# Altium project SmartChessBoard.PrjPcb
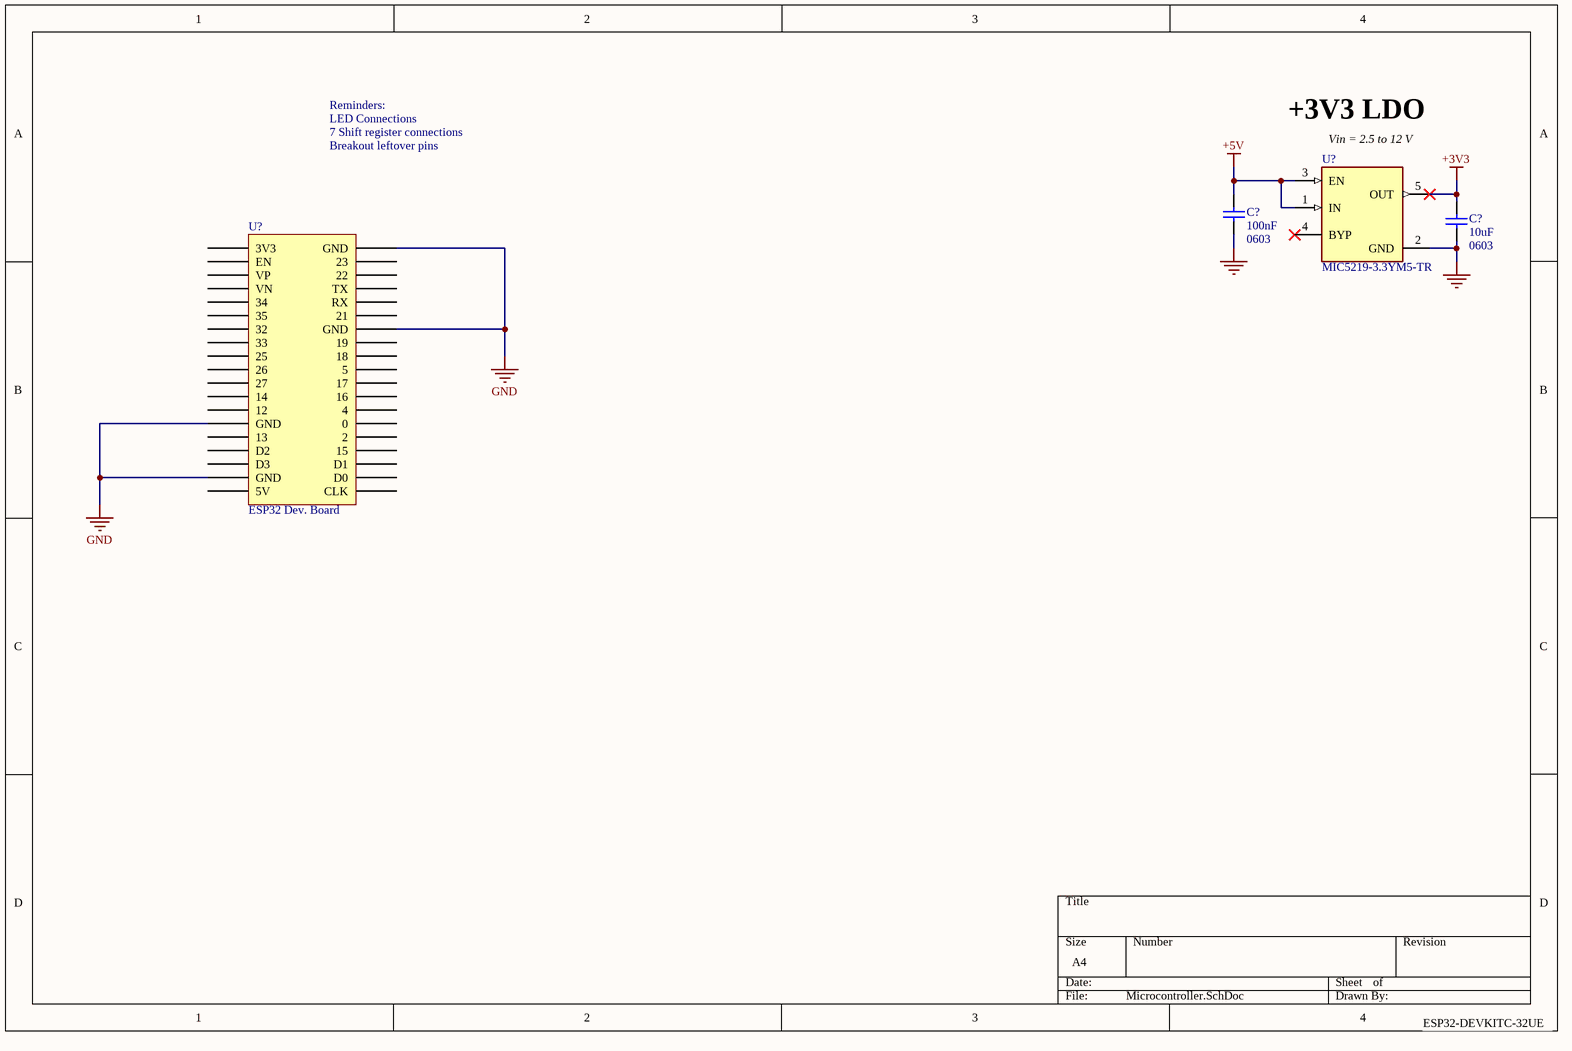
[diagram p0: Microcontroller.SchDoc]
4 sheets, 271 parts. Net scope: flat (ports and power ports of the same name join across sheets).
Board file: Chess Board PCB.PcbDoc
Sheets:
  Microcontroller.SchDoc
  Reed Switches.SchDoc
  LEDs.SchDoc
  Shift Registers.SchDoc

## Sheet Microcontroller.SchDoc
size A4; SheetNumber: 1; SheetTotal: 4

### Parts
(Parts that share a designator on the sheet are numbered #1, #2 ... from top to bottom, then left to right.)
C?#1  100nF  value 0603  [0603 CAP SAMSUNG CL10C]
C?#2  10uF  value 0603  [0603 CAP]
U?#1  MIC5219-3.3YM5-TR  [FP-SOT23-5LD-PL-1-IPC_C]
U?#2  ESP32 Dev. Board

### Nets
+3V3: C?#2.2 U?#1.5(OUT)
+5V: C?#1.2 U?#1.1(IN) U?#1.3(EN)
GND: C?#1.1 C?#2.1 U?#1.2(GND) U?#2.14(GND) U?#2.18(GND) U?#2.32(GND) U?#2.38(GND)

Not connected (* = marked no-connect by the designer): U?#1 4(BYP)*; U?#2 1(3V3) 2(EN) 3(VP) 4(VN) 5(34) 6(35) 7(32) 8(33) 9(25) 10(26) 11(27) 12(14) 13(12) 15(13) 16(D2) 17(D3) 19(5V) 20(CLK) 21(D0) 22(D1) 23(15) 24(2) 25(0) 26(4) 27(16) 28(17) 29(5) 30(18) 31(19) 33(21) 34(RX) 35(TX) 36(22) 37(23)

### Notes on the sheet
- Reminders:
- LED Connections
- 7 Shift register connections
- Breakout leftover pins
- +3V3 LDO
- (near U?#1) Vin = 2.5 to 12 V
- ESP32-DEVKITC-32UE

### Library data of the parts
C?#1 C?#2 = Cap: Capacitor; Published: 8-Jun-2000; LatestRevisionDate: 17-Jul-2002; LatestRevisionNote: Re-released for DXP Platform.; PackageReference: RAD-0.3; Publisher: Altium Limited; PackageDescription: Radial Cap, Thru-Hole; 2 Leads; 0.3 in Pin Spacing
U?#1 = CMP-06324-000027-1: IC REG LINEAR 3.3V 500MA SOT23-5; Dropout Voltage: 350mV; Output Type: Fixed; Number of Regulators: 1; Max Input Voltage: 12V; Min Input Voltage: 2.5V; Min Operating Temperature: -40°C; Nominal Output Voltage: 3.3V; Output Voltage: 3.3V; Packaging: Cut Tape; Mount: Surface Mount; Number of Pins: 5; Case/Package: SOT-23-5; Lead Free: Lead Free; Max Operating Temperature: 125°C; REACH SVHC: No SVHC; Output Current: 500mA
U?#2 = ESP32 Dev. Board: ESP32-WROOM-32UE Series Evaluation Board 802.11 b/g/n (WiFi, WLAN) Bluetooth Smart Ready 4.x Dual Mode; Manufacturer: Espressif Systems; Manufacturer Part Number: ESP32-DEVKITC-32UE; Supplier: Digikey; Supplier Part Number: 1965-ESP32-DEVKITC-32UE-ND; RoHS: No; Category: RF Semiconductors and Devices; Stock: 498; Pricing: 1=10 (USD); ComponentLink1URL: https://www.espressif.com/sites/default/files/documentation/espressif_products_ordering_information_en.pdf?src-supplier=Digikey; ComponentLink1Description: https://www.espressif.com/sites/default/files/documentation/espressif_products_ordering_information_en.pdf?src-supplier=Digikey; ComponentLink2URL: https://datasheet.octopart.com/ESP32-DEVKITC-32UE-Espressif-Systems-datasheet-165560559.pdf?src-supplier=TME; ComponentLink2Description: https://datasheet.octopart.com/ESP32-DEVKITC-32UE-Espressif-Systems-datasheet-165560559.pdf?src-supplier=TME

## Sheet Reed Switches.SchDoc
size A3; SheetNumber: 3; SheetTotal: 5
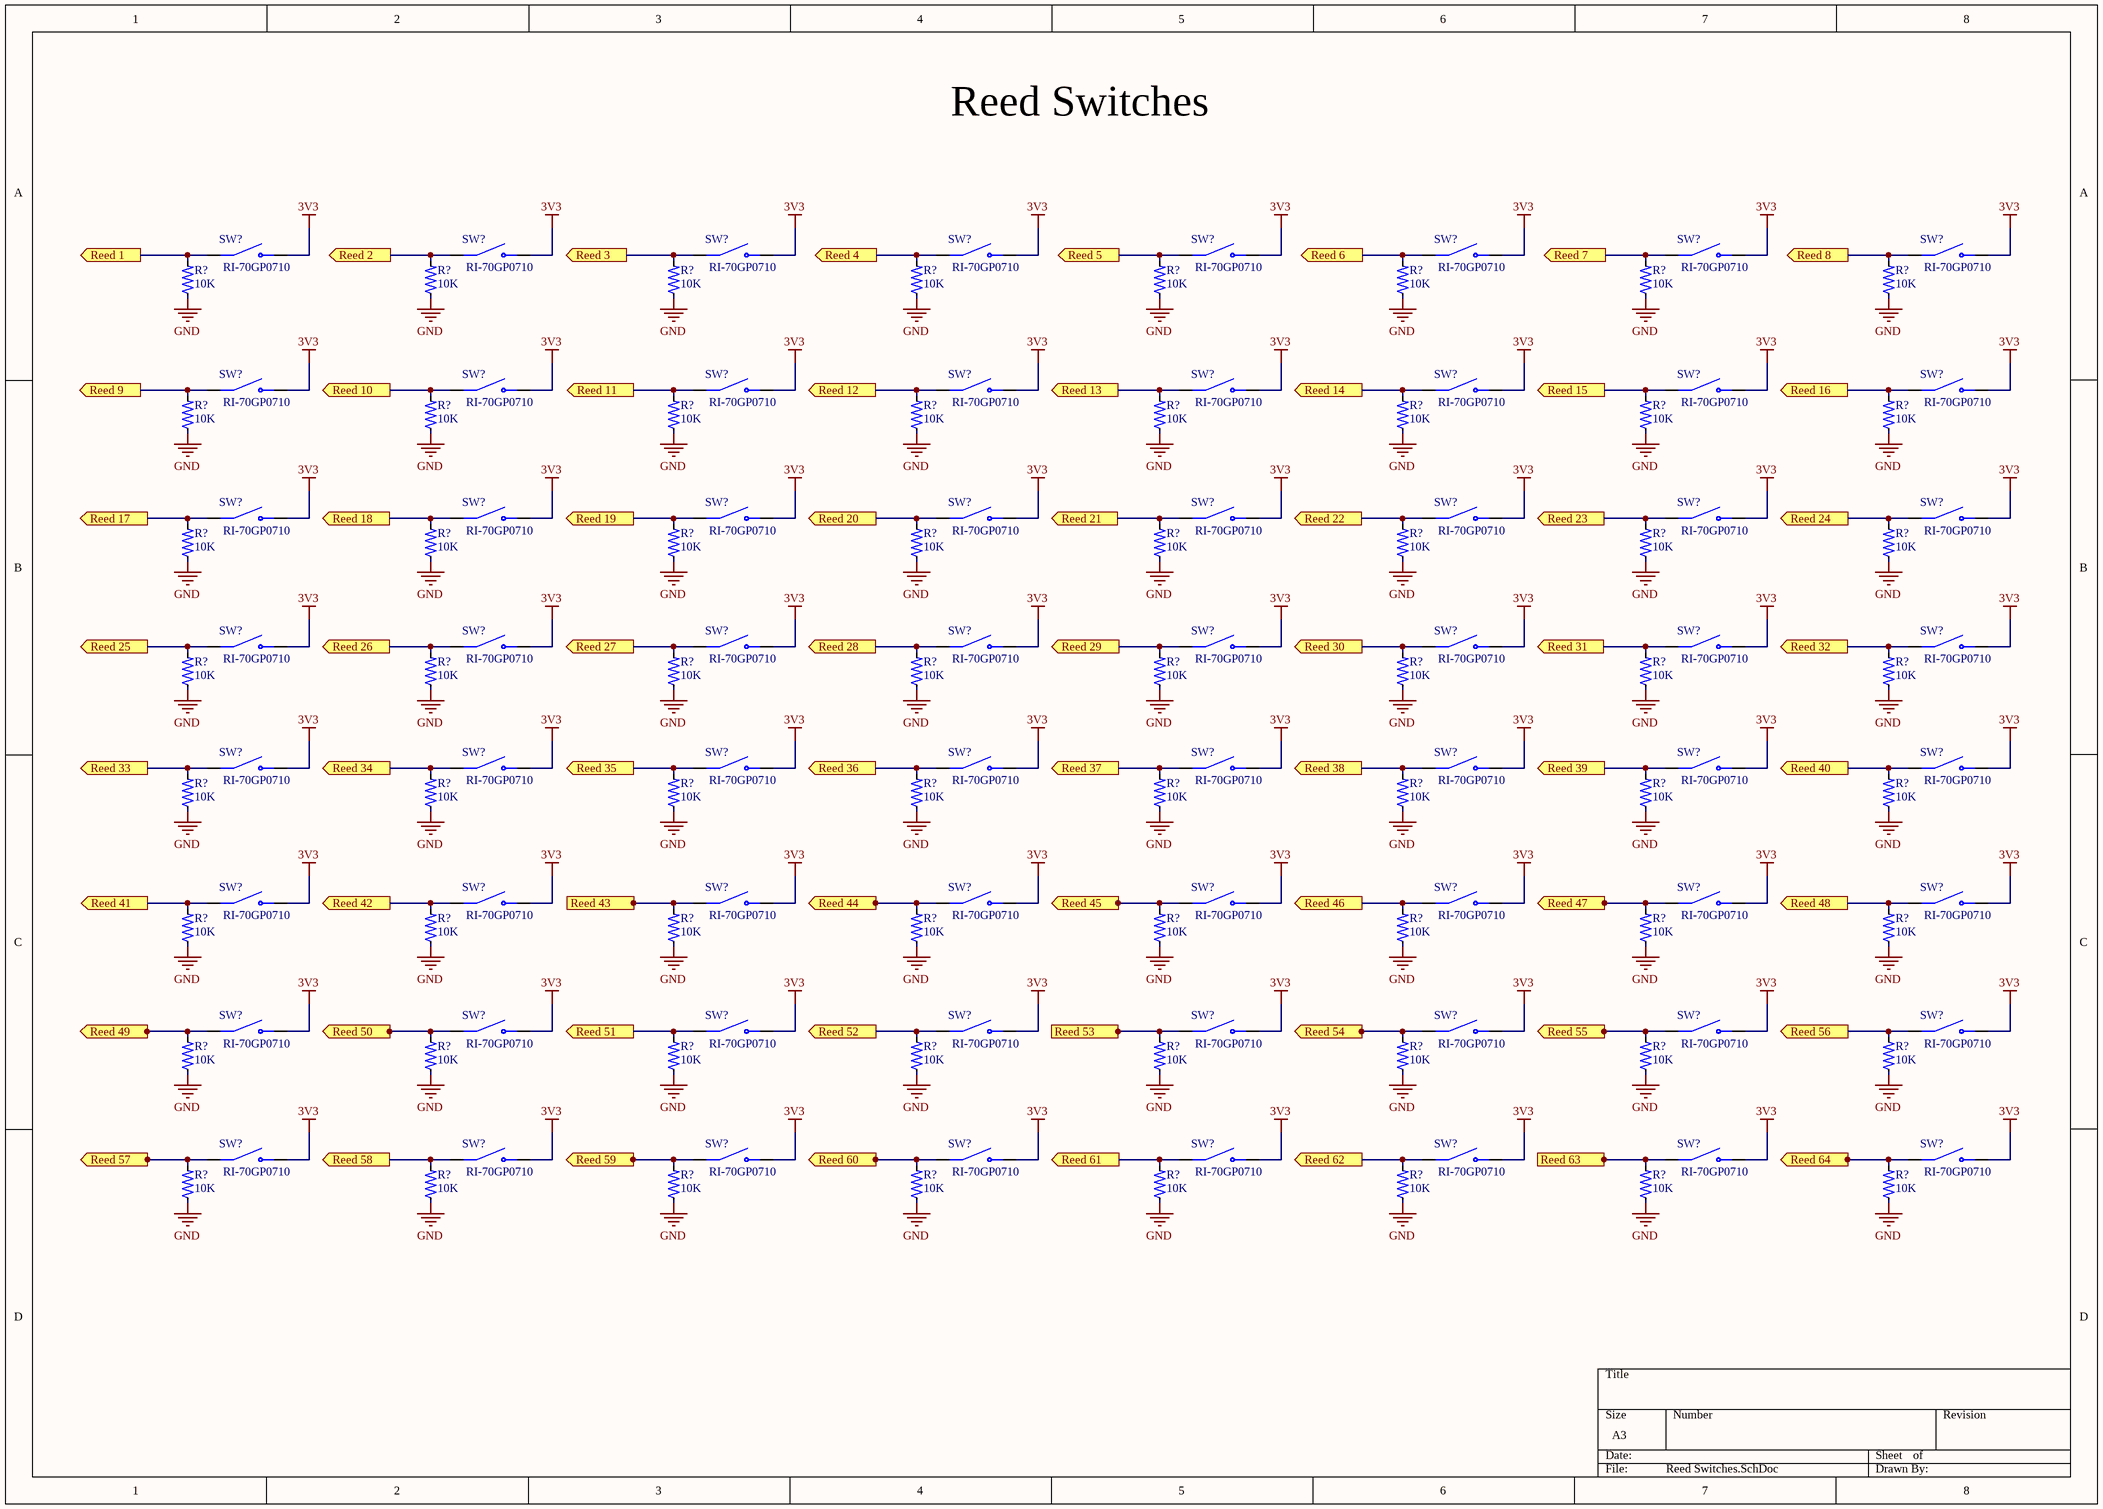
[diagram p1: Reed Switches.SchDoc]

### Parts
(Parts that share a designator on the sheet are numbered #1, #2 ... from top to bottom, then left to right.)
R?#1  10K  [res 0805]
R?#2  10K  [res 0805]
R?#3  10K  [res 0805]
R?#4  10K  [res 0805]
R?#5  10K  [res 0805]
R?#6  10K  [res 0805]
R?#7  10K  [res 0805]
R?#8  10K  [res 0805]
R?#9  10K  [res 0805]
R?#10  10K  [res 0805]
R?#11  10K  [res 0805]
R?#12  10K  [res 0805]
R?#13  10K  [res 0805]
R?#14  10K  [res 0805]
R?#15  10K  [res 0805]
R?#16  10K  [res 0805]
R?#17  10K  [res 0805]
R?#18  10K  [res 0805]
R?#19  10K  [res 0805]
R?#20  10K  [res 0805]
R?#21  10K  [res 0805]
R?#22  10K  [res 0805]
R?#23  10K  [res 0805]
R?#24  10K  [res 0805]
R?#25  10K  [res 0805]
R?#26  10K  [res 0805]
R?#27  10K  [res 0805]
R?#28  10K  [res 0805]
R?#29  10K  [res 0805]
R?#30  10K  [res 0805]
R?#31  10K  [res 0805]
R?#32  10K  [res 0805]
R?#33  10K  [res 0805]
R?#34  10K  [res 0805]
R?#35  10K  [res 0805]
R?#36  10K  [res 0805]
R?#37  10K  [res 0805]
R?#38  10K  [res 0805]
R?#39  10K  [res 0805]
R?#40  10K  [res 0805]
R?#41  10K  [res 0805]
R?#42  10K  [res 0805]
R?#43  10K  [res 0805]
R?#44  10K  [res 0805]
R?#45  10K  [res 0805]
R?#46  10K  [res 0805]
R?#47  10K  [res 0805]
R?#48  10K  [res 0805]
R?#49  10K  [res 0805]
R?#50  10K  [res 0805]
R?#51  10K  [res 0805]
R?#52  10K  [res 0805]
R?#53  10K  [res 0805]
R?#54  10K  [res 0805]
R?#55  10K  [res 0805]
R?#56  10K  [res 0805]
R?#57  10K  [res 0805]
R?#58  10K  [res 0805]
R?#59  10K  [res 0805]
R?#60  10K  [res 0805]
R?#61  10K  [res 0805]
R?#62  10K  [res 0805]
R?#63  10K  [res 0805]
R?#64  10K  [res 0805]
SW?#1  RI-70GP0710
SW?#2  RI-70GP0710
SW?#3  RI-70GP0710
SW?#4  RI-70GP0710
SW?#5  RI-70GP0710
SW?#6  RI-70GP0710
SW?#7  RI-70GP0710
SW?#8  RI-70GP0710
SW?#9  RI-70GP0710
SW?#10  RI-70GP0710
SW?#11  RI-70GP0710
SW?#12  RI-70GP0710
SW?#13  RI-70GP0710
SW?#14  RI-70GP0710
SW?#15  RI-70GP0710
SW?#16  RI-70GP0710
SW?#17  RI-70GP0710
SW?#18  RI-70GP0710
SW?#19  RI-70GP0710
SW?#20  RI-70GP0710
SW?#21  RI-70GP0710
SW?#22  RI-70GP0710
SW?#23  RI-70GP0710
SW?#24  RI-70GP0710
SW?#25  RI-70GP0710
SW?#26  RI-70GP0710
SW?#27  RI-70GP0710
SW?#28  RI-70GP0710
SW?#29  RI-70GP0710
SW?#30  RI-70GP0710
SW?#31  RI-70GP0710
SW?#32  RI-70GP0710
SW?#33  RI-70GP0710
SW?#34  RI-70GP0710
SW?#35  RI-70GP0710
SW?#36  RI-70GP0710
SW?#37  RI-70GP0710
SW?#38  RI-70GP0710
SW?#39  RI-70GP0710
SW?#40  RI-70GP0710
SW?#41  RI-70GP0710
SW?#42  RI-70GP0710
SW?#43  RI-70GP0710
SW?#44  RI-70GP0710
SW?#45  RI-70GP0710
SW?#46  RI-70GP0710
SW?#47  RI-70GP0710
SW?#48  RI-70GP0710
SW?#49  RI-70GP0710
SW?#50  RI-70GP0710
SW?#51  RI-70GP0710
SW?#52  RI-70GP0710
SW?#53  RI-70GP0710
SW?#54  RI-70GP0710
SW?#55  RI-70GP0710
SW?#56  RI-70GP0710
SW?#57  RI-70GP0710
SW?#58  RI-70GP0710
SW?#59  RI-70GP0710
SW?#60  RI-70GP0710
SW?#61  RI-70GP0710
SW?#62  RI-70GP0710
SW?#63  RI-70GP0710
SW?#64  RI-70GP0710

### Ports
Reed 1 (out), Reed 2 (out), Reed 3 (out), Reed 4 (out), Reed 5 (out), Reed 6 (out), Reed 7 (out), Reed 8 (out), Reed 9 (out), Reed 10 (out), Reed 11 (out), Reed 12 (out), Reed 13 (out), Reed 14 (out), Reed 15 (out), Reed 16 (out), Reed 17 (out), Reed 18 (out), Reed 19 (out), Reed 20 (out), Reed 21 (out), Reed 22 (out), Reed 23 (out), Reed 24 (out), Reed 25 (out), Reed 26 (out), Reed 27 (out), Reed 28 (out), Reed 29 (out), Reed 30 (out), Reed 31 (out), Reed 32 (out), Reed 33 (out), Reed 34 (out), Reed 35 (out), Reed 36 (out), Reed 37 (out), Reed 38 (out), Reed 39 (out), Reed 40 (out), Reed 41 (out), Reed 42 (out), Reed 43 (out), Reed 44 (out), Reed 45 (out), Reed 46 (out), Reed 47 (out), Reed 48 (out), Reed 49 (out), Reed 50 (out), Reed 51 (out), Reed 52 (out), Reed 53 (out), Reed 54 (out), Reed 55 (out), Reed 56 (out), Reed 57 (out), Reed 58 (out), Reed 59 (out), Reed 60 (out), Reed 61 (out), Reed 62 (out), Reed 63 (out), Reed 64 (out)

### Nets
3V3: SW?#1.2(NO) SW?#2.2(NO) SW?#3.2(NO) SW?#4.2(NO) SW?#5.2(NO) SW?#6.2(NO) SW?#7.2(NO) SW?#8.2(NO) SW?#9.2(NO) SW?#10.2(NO) SW?#11.2(NO) SW?#12.2(NO) SW?#13.2(NO) SW?#14.2(NO) SW?#15.2(NO) SW?#16.2(NO) SW?#17.2(NO) SW?#18.2(NO) SW?#19.2(NO) SW?#20.2(NO) SW?#21.2(NO) SW?#22.2(NO) SW?#23.2(NO) SW?#24.2(NO) SW?#25.2(NO) SW?#26.2(NO) SW?#27.2(NO) SW?#28.2(NO) SW?#29.2(NO) SW?#30.2(NO) SW?#31.2(NO) SW?#32.2(NO) SW?#33.2(NO) SW?#34.2(NO) SW?#35.2(NO) SW?#36.2(NO) SW?#37.2(NO) SW?#38.2(NO) SW?#39.2(NO) SW?#40.2(NO) SW?#41.2(NO) SW?#42.2(NO) SW?#43.2(NO) SW?#44.2(NO) SW?#45.2(NO) SW?#46.2(NO) SW?#47.2(NO) SW?#48.2(NO) SW?#49.2(NO) SW?#50.2(NO) SW?#51.2(NO) SW?#52.2(NO) SW?#53.2(NO) SW?#54.2(NO) SW?#55.2(NO) SW?#56.2(NO) SW?#57.2(NO) SW?#58.2(NO) SW?#59.2(NO) SW?#60.2(NO) SW?#61.2(NO) SW?#62.2(NO) SW?#63.2(NO) SW?#64.2(NO)
GND: R?#1.1 R?#2.1 R?#3.1 R?#4.1 R?#5.1 R?#6.1 R?#7.1 R?#8.1 R?#9.1 R?#10.1 R?#11.1 R?#12.1 R?#13.1 R?#14.1 R?#15.1 R?#16.1 R?#17.1 R?#18.1 R?#19.1 R?#20.1 R?#21.1 R?#22.1 R?#23.1 R?#24.1 R?#25.1 R?#26.1 R?#27.1 R?#28.1 R?#29.1 R?#30.1 R?#31.1 R?#32.1 R?#33.1 R?#34.1 R?#35.1 R?#36.1 R?#37.1 R?#38.1 R?#39.1 R?#40.1 R?#41.1 R?#42.1 R?#43.1 R?#44.1 R?#45.1 R?#46.1 R?#47.1 R?#48.1 R?#49.1 R?#50.1 R?#51.1 R?#52.1 R?#53.1 R?#54.1 R?#55.1 R?#56.1 R?#57.1 R?#58.1 R?#59.1 R?#60.1 R?#61.1 R?#62.1 R?#63.1 R?#64.1
NetR?#1_2: R?#1.2 SW?#1.1(COM) ; port Reed 1
NetR?#2_2: R?#2.2 SW?#2.1(COM) ; port Reed 2
NetR?#3_2: R?#3.2 SW?#3.1(COM) ; port Reed 3
NetR?#4_2: R?#4.2 SW?#4.1(COM) ; port Reed 4
NetR?#5_2: R?#5.2 SW?#5.1(COM) ; port Reed 5
NetR?#6_2: R?#6.2 SW?#6.1(COM) ; port Reed 6
NetR?#7_2: R?#7.2 SW?#7.1(COM) ; port Reed 7
NetR?#8_2: R?#8.2 SW?#8.1(COM) ; port Reed 8
NetR?#9_2: R?#9.2 SW?#9.1(COM) ; port Reed 9
NetR?#10_2: R?#10.2 SW?#10.1(COM) ; port Reed 10
NetR?#11_2: R?#11.2 SW?#11.1(COM) ; port Reed 11
NetR?#12_2: R?#12.2 SW?#12.1(COM) ; port Reed 12
NetR?#13_2: R?#13.2 SW?#13.1(COM) ; port Reed 13
NetR?#14_2: R?#14.2 SW?#14.1(COM) ; port Reed 14
NetR?#15_2: R?#15.2 SW?#15.1(COM) ; port Reed 15
NetR?#16_2: R?#16.2 SW?#16.1(COM) ; port Reed 16
NetR?#17_2: R?#17.2 SW?#17.1(COM) ; port Reed 17
NetR?#18_2: R?#18.2 SW?#18.1(COM) ; port Reed 18
NetR?#19_2: R?#19.2 SW?#19.1(COM) ; port Reed 19
NetR?#20_2: R?#20.2 SW?#20.1(COM) ; port Reed 20
NetR?#21_2: R?#21.2 SW?#21.1(COM) ; port Reed 21
NetR?#22_2: R?#22.2 SW?#22.1(COM) ; port Reed 22
NetR?#23_2: R?#23.2 SW?#23.1(COM) ; port Reed 23
NetR?#24_2: R?#24.2 SW?#24.1(COM) ; port Reed 24
NetR?#25_2: R?#25.2 SW?#25.1(COM) ; port Reed 25
NetR?#26_2: R?#26.2 SW?#26.1(COM) ; port Reed 26
NetR?#27_2: R?#27.2 SW?#27.1(COM) ; port Reed 27
NetR?#28_2: R?#28.2 SW?#28.1(COM) ; port Reed 28
NetR?#29_2: R?#29.2 SW?#29.1(COM) ; port Reed 29
NetR?#30_2: R?#30.2 SW?#30.1(COM) ; port Reed 30
NetR?#31_2: R?#31.2 SW?#31.1(COM) ; port Reed 31
NetR?#32_2: R?#32.2 SW?#32.1(COM) ; port Reed 32
NetR?#33_2: R?#33.2 SW?#33.1(COM) ; port Reed 33
NetR?#34_2: R?#34.2 SW?#34.1(COM) ; port Reed 34
NetR?#35_2: R?#35.2 SW?#35.1(COM) ; port Reed 35
NetR?#36_2: R?#36.2 SW?#36.1(COM) ; port Reed 36
NetR?#37_2: R?#37.2 SW?#37.1(COM) ; port Reed 37
NetR?#38_2: R?#38.2 SW?#38.1(COM) ; port Reed 38
NetR?#39_2: R?#39.2 SW?#39.1(COM) ; port Reed 39
NetR?#40_2: R?#40.2 SW?#40.1(COM) ; port Reed 40
NetR?#41_2: R?#41.2 SW?#41.1(COM) ; port Reed 41
NetR?#42_2: R?#42.2 SW?#42.1(COM) ; port Reed 42
NetR?#43_2: R?#43.2 SW?#43.1(COM) ; port Reed 43
NetR?#44_2: R?#44.2 SW?#44.1(COM) ; port Reed 44
NetR?#45_2: R?#45.2 SW?#45.1(COM) ; port Reed 45
NetR?#46_2: R?#46.2 SW?#46.1(COM) ; port Reed 46
NetR?#47_2: R?#47.2 SW?#47.1(COM) ; port Reed 47
NetR?#48_2: R?#48.2 SW?#48.1(COM) ; port Reed 48
NetR?#49_2: R?#49.2 SW?#49.1(COM) ; port Reed 49
NetR?#50_2: R?#50.2 SW?#50.1(COM) ; port Reed 50
NetR?#51_2: R?#51.2 SW?#51.1(COM) ; port Reed 51
NetR?#52_2: R?#52.2 SW?#52.1(COM) ; port Reed 52
NetR?#53_2: R?#53.2 SW?#53.1(COM) ; port Reed 53
NetR?#54_2: R?#54.2 SW?#54.1(COM) ; port Reed 54
NetR?#55_2: R?#55.2 SW?#55.1(COM) ; port Reed 55
NetR?#56_2: R?#56.2 SW?#56.1(COM) ; port Reed 56
NetR?#57_2: R?#57.2 SW?#57.1(COM) ; port Reed 57
NetR?#58_2: R?#58.2 SW?#58.1(COM) ; port Reed 58
NetR?#59_2: R?#59.2 SW?#59.1(COM) ; port Reed 59
NetR?#60_2: R?#60.2 SW?#60.1(COM) ; port Reed 60
NetR?#61_2: R?#61.2 SW?#61.1(COM) ; port Reed 61
NetR?#62_2: R?#62.2 SW?#62.1(COM) ; port Reed 62
NetR?#63_2: R?#63.2 SW?#63.1(COM) ; port Reed 63
NetR?#64_2: R?#64.2 SW?#64.1(COM) ; port Reed 64

### Notes on the sheet
- Reed Switches

### Library data of the parts
R?#1-R?#64 = Resistor 0805: MP: 2-2176053-2; Resistance: .39; Power_Rating: .25 W; MF: TE Connectivity; Tolerance: 1%; Package: 0805; Value: *; SnapEDA_Link: https://www.snapeda.com/parts/2-2176053-2/TE%20Connectivity/view-part/2214511/?ref=snap; Availability: Unavailable; Price: None; EU_RoHS_Compliance: Compliant with Exemptions
SW?#1-SW?#64 = RI-70GP0710: Switch Reed Spst-no 500MA 120V; Manufacturer: Comus; Supplier: Digikey; Supplier Part Number: 1835-1025-ND; Manufacturer Part Number: RI-70GP0710; RoHS: No; Stock: 52347; Pricing: 1=1.05, 10=1.01, 25=0.9496, 100=0.8201, 250=0.7474, 500=0.69488, 2000=0.6464, 4000=0.5858, 6000=0.5454 (USD); ComponentLink1URL: https://www.comus-intl.com/wp-content/uploads/2018/10/RI-70GP.pdf?src-supplier=Digikey; ComponentLink1Description: https://www.comus-intl.com/wp-content/uploads/2018/10/RI-70GP.pdf?src-supplier=Digikey

## Sheet LEDs.SchDoc
size A3; SheetNumber: 3; SheetTotal: 4
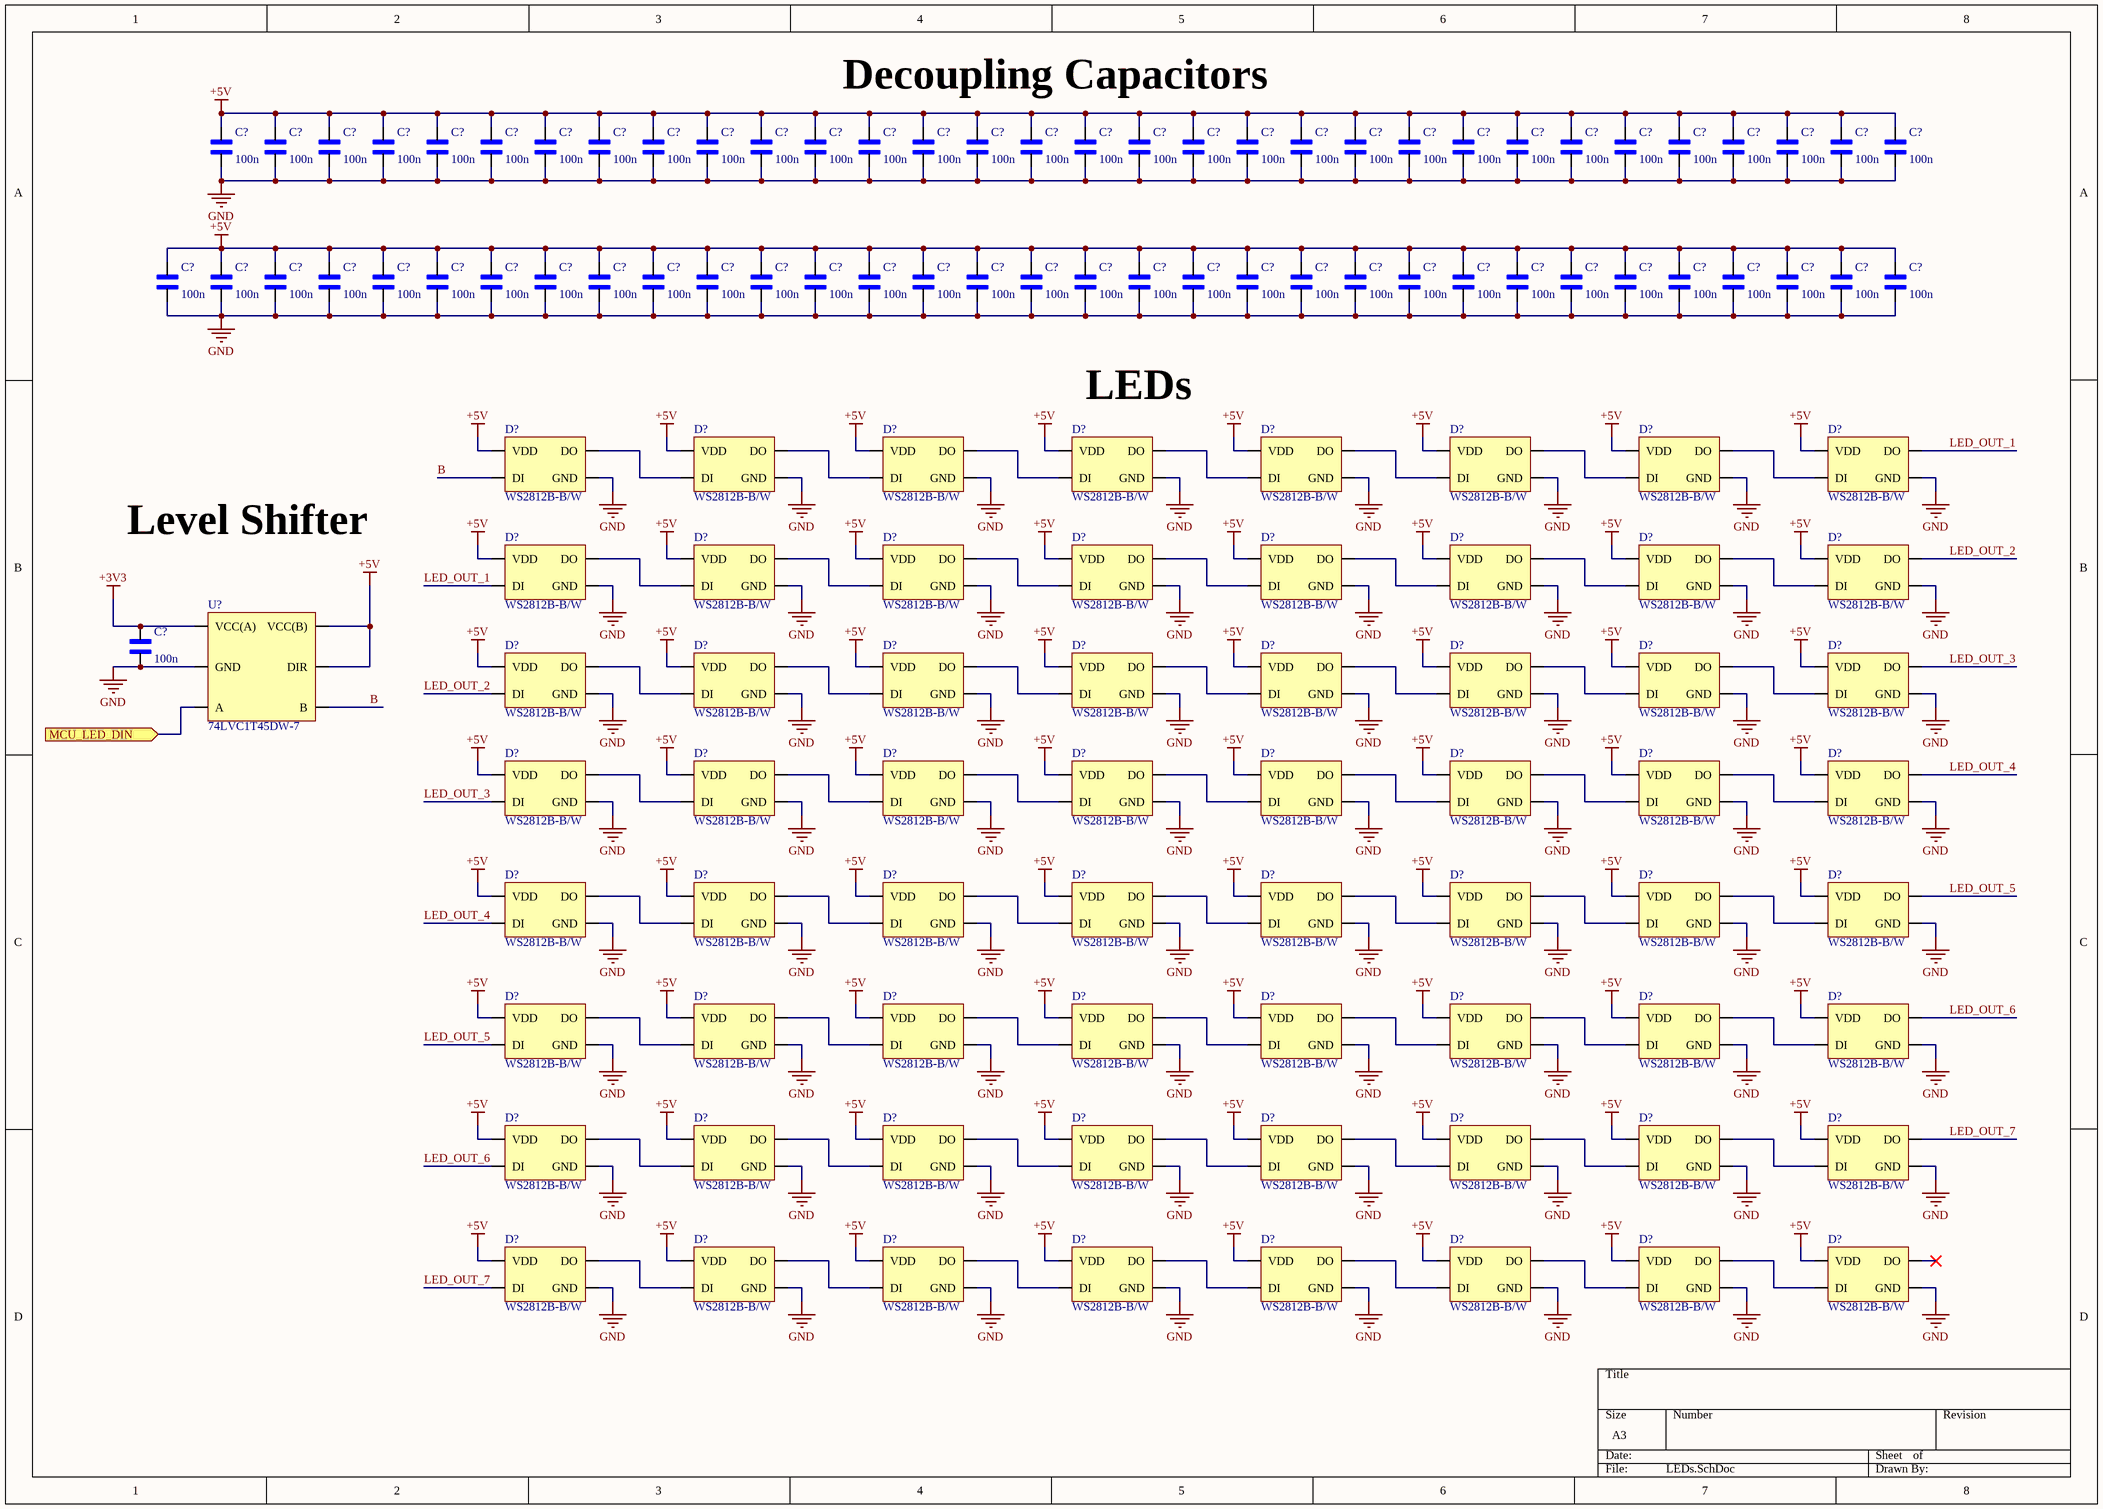
[diagram p2: LEDs.SchDoc]

### Parts
(Parts that share a designator on the sheet are numbered #1, #2 ... from top to bottom, then left to right.)
C?#3  100n  [CAP 0805]
C?#4  100n  [CAP 0805]
C?#5  100n  [CAP 0805]
C?#6  100n  [CAP 0805]
C?#7  100n  [CAP 0805]
C?#8  100n  [CAP 0805]
C?#9  100n  [CAP 0805]
C?#10  100n  [CAP 0805]
C?#11  100n  [CAP 0805]
C?#12  100n  [CAP 0805]
C?#13  100n  [CAP 0805]
C?#14  100n  [CAP 0805]
C?#15  100n  [CAP 0805]
C?#16  100n  [CAP 0805]
C?#17  100n  [CAP 0805]
C?#18  100n  [CAP 0805]
C?#19  100n  [CAP 0805]
C?#20  100n  [CAP 0805]
C?#21  100n  [CAP 0805]
C?#22  100n  [CAP 0805]
C?#23  100n  [CAP 0805]
C?#24  100n  [CAP 0805]
C?#25  100n  [CAP 0805]
C?#26  100n  [CAP 0805]
C?#27  100n  [CAP 0805]
C?#28  100n  [CAP 0805]
C?#29  100n  [CAP 0805]
C?#30  100n  [CAP 0805]
C?#31  100n  [CAP 0805]
C?#32  100n  [CAP 0805]
C?#33  100n  [CAP 0805]
C?#34  100n  [CAP 0805]
C?#35  100n  [CAP 0805]
C?#36  100n  [CAP 0805]
C?#37  100n  [CAP 0805]
C?#38  100n  [CAP 0805]
C?#39  100n  [CAP 0805]
C?#40  100n  [CAP 0805]
C?#41  100n  [CAP 0805]
C?#42  100n  [CAP 0805]
C?#43  100n  [CAP 0805]
C?#44  100n  [CAP 0805]
C?#45  100n  [CAP 0805]
C?#46  100n  [CAP 0805]
C?#47  100n  [CAP 0805]
C?#48  100n  [CAP 0805]
C?#49  100n  [CAP 0805]
C?#50  100n  [CAP 0805]
C?#51  100n  [CAP 0805]
C?#52  100n  [CAP 0805]
C?#53  100n  [CAP 0805]
C?#54  100n  [CAP 0805]
C?#55  100n  [CAP 0805]
C?#56  100n  [CAP 0805]
C?#57  100n  [CAP 0805]
C?#58  100n  [CAP 0805]
C?#59  100n  [CAP 0805]
C?#60  100n  [CAP 0805]
C?#61  100n  [CAP 0805]
C?#62  100n  [CAP 0805]
C?#63  100n  [CAP 0805]
C?#64  100n  [CAP 0805]
C?#65  100n  [CAP 0805]
C?#66  100n  [CAP 0805]
C?#67  100n  [CAP 0805]
C?#68  100n  [CAP 0805]
D?#1  WS2812B-B/W
D?#2  WS2812B-B/W
D?#3  WS2812B-B/W
D?#4  WS2812B-B/W
D?#5  WS2812B-B/W
D?#6  WS2812B-B/W
D?#7  WS2812B-B/W
D?#8  WS2812B-B/W
D?#9  WS2812B-B/W
D?#10  WS2812B-B/W
D?#11  WS2812B-B/W
D?#12  WS2812B-B/W
D?#13  WS2812B-B/W
D?#14  WS2812B-B/W
D?#15  WS2812B-B/W
D?#16  WS2812B-B/W
D?#17  WS2812B-B/W
D?#18  WS2812B-B/W
D?#19  WS2812B-B/W
D?#20  WS2812B-B/W
D?#21  WS2812B-B/W
D?#22  WS2812B-B/W
D?#23  WS2812B-B/W
D?#24  WS2812B-B/W
D?#25  WS2812B-B/W
D?#26  WS2812B-B/W
D?#27  WS2812B-B/W
D?#28  WS2812B-B/W
D?#29  WS2812B-B/W
D?#30  WS2812B-B/W
D?#31  WS2812B-B/W
D?#32  WS2812B-B/W
D?#33  WS2812B-B/W
D?#34  WS2812B-B/W
D?#35  WS2812B-B/W
D?#36  WS2812B-B/W
D?#37  WS2812B-B/W
D?#38  WS2812B-B/W
D?#39  WS2812B-B/W
D?#40  WS2812B-B/W
D?#41  WS2812B-B/W
D?#42  WS2812B-B/W
D?#43  WS2812B-B/W
D?#44  WS2812B-B/W
D?#45  WS2812B-B/W
D?#46  WS2812B-B/W
D?#47  WS2812B-B/W
D?#48  WS2812B-B/W
D?#49  WS2812B-B/W
D?#50  WS2812B-B/W
D?#51  WS2812B-B/W
D?#52  WS2812B-B/W
D?#53  WS2812B-B/W
D?#54  WS2812B-B/W
D?#55  WS2812B-B/W
D?#56  WS2812B-B/W
D?#57  WS2812B-B/W
D?#58  WS2812B-B/W
D?#59  WS2812B-B/W
D?#60  WS2812B-B/W
D?#61  WS2812B-B/W
D?#62  WS2812B-B/W
D?#63  WS2812B-B/W
D?#64  WS2812B-B/W
U?#3  74LVC1T45DW-7  [74LVC1T45DW-7]

### Ports
MCU_LED_DIN (in)

### Nets
+3V3: C?#68.2 U?#3.1(VCC(A))
+5V: C?#3.2 C?#4.2 C?#5.2 C?#6.2 C?#7.2 C?#8.2 C?#9.2 C?#10.2 C?#11.2 C?#12.2 C?#13.2 C?#14.2 C?#15.2 C?#16.2 C?#17.2 C?#18.2 C?#19.2 C?#20.2 C?#21.2 C?#22.2 C?#23.2 C?#24.2 C?#25.2 C?#26.2 C?#27.2 C?#28.2 C?#29.2 C?#30.2 C?#31.2 C?#32.2 C?#33.2 C?#34.2 C?#35.2 C?#36.2 C?#37.2 C?#38.2 C?#39.2 C?#40.2 C?#41.2 C?#42.2 C?#43.2 C?#44.2 C?#45.2 C?#46.2 C?#47.2 C?#48.2 C?#49.2 C?#50.2 C?#51.2 C?#52.2 C?#53.2 C?#54.2 C?#55.2 C?#56.2 C?#57.2 C?#58.2 C?#59.2 C?#60.2 C?#61.2 C?#62.2 C?#63.2 C?#64.2 C?#65.2 C?#66.2 C?#67.2 D?#1.1(VDD) D?#2.1(VDD) D?#3.1(VDD) D?#4.1(VDD) D?#5.1(VDD) D?#6.1(VDD) D?#7.1(VDD) D?#8.1(VDD) D?#9.1(VDD) D?#10.1(VDD) D?#11.1(VDD) D?#12.1(VDD) D?#13.1(VDD) D?#14.1(VDD) D?#15.1(VDD) D?#16.1(VDD) D?#17.1(VDD) D?#18.1(VDD) D?#19.1(VDD) D?#20.1(VDD) D?#21.1(VDD) D?#22.1(VDD) D?#23.1(VDD) D?#24.1(VDD) D?#25.1(VDD) D?#26.1(VDD) D?#27.1(VDD) D?#28.1(VDD) D?#29.1(VDD) D?#30.1(VDD) D?#31.1(VDD) D?#32.1(VDD) D?#33.1(VDD) D?#34.1(VDD) D?#35.1(VDD) D?#36.1(VDD) D?#37.1(VDD) D?#38.1(VDD) D?#39.1(VDD) D?#40.1(VDD) D?#41.1(VDD) D?#42.1(VDD) D?#43.1(VDD) D?#44.1(VDD) D?#45.1(VDD) D?#46.1(VDD) D?#47.1(VDD) D?#48.1(VDD) D?#49.1(VDD) D?#50.1(VDD) D?#51.1(VDD) D?#52.1(VDD) D?#53.1(VDD) D?#54.1(VDD) D?#55.1(VDD) D?#56.1(VDD) D?#57.1(VDD) D?#58.1(VDD) D?#59.1(VDD) D?#60.1(VDD) D?#61.1(VDD) D?#62.1(VDD) D?#63.1(VDD) D?#64.1(VDD) U?#3.5(DIR) U?#3.6(VCC(B))
GND: C?#3.1 C?#4.1 C?#5.1 C?#6.1 C?#7.1 C?#8.1 C?#9.1 C?#10.1 C?#11.1 C?#12.1 C?#13.1 C?#14.1 C?#15.1 C?#16.1 C?#17.1 C?#18.1 C?#19.1 C?#20.1 C?#21.1 C?#22.1 C?#23.1 C?#24.1 C?#25.1 C?#26.1 C?#27.1 C?#28.1 C?#29.1 C?#30.1 C?#31.1 C?#32.1 C?#33.1 C?#34.1 C?#35.1 C?#36.1 C?#37.1 C?#38.1 C?#39.1 C?#40.1 C?#41.1 C?#42.1 C?#43.1 C?#44.1 C?#45.1 C?#46.1 C?#47.1 C?#48.1 C?#49.1 C?#50.1 C?#51.1 C?#52.1 C?#53.1 C?#54.1 C?#55.1 C?#56.1 C?#57.1 C?#58.1 C?#59.1 C?#60.1 C?#61.1 C?#62.1 C?#63.1 C?#64.1 C?#65.1 C?#66.1 C?#67.1 C?#68.1 D?#1.4(GND) D?#2.4(GND) D?#3.4(GND) D?#4.4(GND) D?#5.4(GND) D?#6.4(GND) D?#7.4(GND) D?#8.4(GND) D?#9.4(GND) D?#10.4(GND) D?#11.4(GND) D?#12.4(GND) D?#13.4(GND) D?#14.4(GND) D?#15.4(GND) D?#16.4(GND) D?#17.4(GND) D?#18.4(GND) D?#19.4(GND) D?#20.4(GND) D?#21.4(GND) D?#22.4(GND) D?#23.4(GND) D?#24.4(GND) D?#25.4(GND) D?#26.4(GND) D?#27.4(GND) D?#28.4(GND) D?#29.4(GND) D?#30.4(GND) D?#31.4(GND) D?#32.4(GND) D?#33.4(GND) D?#34.4(GND) D?#35.4(GND) D?#36.4(GND) D?#37.4(GND) D?#38.4(GND) D?#39.4(GND) D?#40.4(GND) D?#41.4(GND) D?#42.4(GND) D?#43.4(GND) D?#44.4(GND) D?#45.4(GND) D?#46.4(GND) D?#47.4(GND) D?#48.4(GND) D?#49.4(GND) D?#50.4(GND) D?#51.4(GND) D?#52.4(GND) D?#53.4(GND) D?#54.4(GND) D?#55.4(GND) D?#56.4(GND) D?#57.4(GND) D?#58.4(GND) D?#59.4(GND) D?#60.4(GND) D?#61.4(GND) D?#62.4(GND) D?#63.4(GND) D?#64.4(GND) U?#3.2(GND)
B: D?#1.2(DI) U?#3.4(B)
LED_OUT_1: D?#8.3(DO) D?#9.2(DI)
LED_OUT_2: D?#16.3(DO) D?#17.2(DI)
LED_OUT_3: D?#24.3(DO) D?#25.2(DI)
LED_OUT_4: D?#32.3(DO) D?#33.2(DI)
LED_OUT_5: D?#40.3(DO) D?#41.2(DI)
LED_OUT_6: D?#48.3(DO) D?#49.2(DI)
LED_OUT_7: D?#56.3(DO) D?#57.2(DI)
NetD?#1_3: D?#1.3(DO) D?#2.2(DI)
NetD?#2_3: D?#2.3(DO) D?#3.2(DI)
NetD?#3_3: D?#3.3(DO) D?#4.2(DI)
NetD?#4_3: D?#4.3(DO) D?#5.2(DI)
NetD?#5_3: D?#5.3(DO) D?#6.2(DI)
NetD?#6_3: D?#6.3(DO) D?#7.2(DI)
NetD?#7_3: D?#7.3(DO) D?#8.2(DI)
NetD?#9_3: D?#9.3(DO) D?#10.2(DI)
NetD?#10_3: D?#10.3(DO) D?#11.2(DI)
NetD?#11_3: D?#11.3(DO) D?#12.2(DI)
NetD?#12_3: D?#12.3(DO) D?#13.2(DI)
NetD?#13_3: D?#13.3(DO) D?#14.2(DI)
NetD?#14_3: D?#14.3(DO) D?#15.2(DI)
NetD?#15_3: D?#15.3(DO) D?#16.2(DI)
NetD?#17_3: D?#17.3(DO) D?#18.2(DI)
NetD?#18_3: D?#18.3(DO) D?#19.2(DI)
NetD?#19_3: D?#19.3(DO) D?#20.2(DI)
NetD?#20_3: D?#20.3(DO) D?#21.2(DI)
NetD?#21_3: D?#21.3(DO) D?#22.2(DI)
NetD?#22_3: D?#22.3(DO) D?#23.2(DI)
NetD?#23_3: D?#23.3(DO) D?#24.2(DI)
NetD?#25_3: D?#25.3(DO) D?#26.2(DI)
NetD?#26_3: D?#26.3(DO) D?#27.2(DI)
NetD?#27_3: D?#27.3(DO) D?#28.2(DI)
NetD?#28_3: D?#28.3(DO) D?#29.2(DI)
NetD?#29_3: D?#29.3(DO) D?#30.2(DI)
NetD?#30_3: D?#30.3(DO) D?#31.2(DI)
NetD?#31_3: D?#31.3(DO) D?#32.2(DI)
NetD?#33_3: D?#33.3(DO) D?#34.2(DI)
NetD?#34_3: D?#34.3(DO) D?#35.2(DI)
NetD?#35_3: D?#35.3(DO) D?#36.2(DI)
NetD?#36_3: D?#36.3(DO) D?#37.2(DI)
NetD?#37_3: D?#37.3(DO) D?#38.2(DI)
NetD?#38_3: D?#38.3(DO) D?#39.2(DI)
NetD?#39_3: D?#39.3(DO) D?#40.2(DI)
NetD?#41_3: D?#41.3(DO) D?#42.2(DI)
NetD?#42_3: D?#42.3(DO) D?#43.2(DI)
NetD?#43_3: D?#43.3(DO) D?#44.2(DI)
NetD?#44_3: D?#44.3(DO) D?#45.2(DI)
NetD?#45_3: D?#45.3(DO) D?#46.2(DI)
NetD?#46_3: D?#46.3(DO) D?#47.2(DI)
NetD?#47_3: D?#47.3(DO) D?#48.2(DI)
NetD?#49_3: D?#49.3(DO) D?#50.2(DI)
NetD?#50_3: D?#50.3(DO) D?#51.2(DI)
NetD?#51_3: D?#51.3(DO) D?#52.2(DI)
NetD?#52_3: D?#52.3(DO) D?#53.2(DI)
NetD?#53_3: D?#53.3(DO) D?#54.2(DI)
NetD?#54_3: D?#54.3(DO) D?#55.2(DI)
NetD?#55_3: D?#55.3(DO) D?#56.2(DI)
NetD?#57_3: D?#57.3(DO) D?#58.2(DI)
NetD?#58_3: D?#58.3(DO) D?#59.2(DI)
NetD?#59_3: D?#59.3(DO) D?#60.2(DI)
NetD?#60_3: D?#60.3(DO) D?#61.2(DI)
NetD?#61_3: D?#61.3(DO) D?#62.2(DI)
NetD?#62_3: D?#62.3(DO) D?#63.2(DI)
NetD?#63_3: D?#63.3(DO) D?#64.2(DI)
NetU?#3_3: U?#3.3(A) ; port MCU_LED_DIN

Not connected (* = marked no-connect by the designer): D?#64 3(DO)*

### Notes on the sheet
- (near C?#15) Decoupling Capacitors
- (near D?#4) LEDs
- Level Shifter

### Library data of the parts
C?#3-C?#68 = CAP 0805: SnapEDA_Link: https://www.snapeda.com/parts/C2012X8R1H104K125AA/TDK/view-part/?ref=snap; Check_prices: https://www.snapeda.com/parts/C2012X8R1H104K125AA/TDK/view-part/?ref=eda; Value: *
D?#1-D?#64 = WS2812B-B/W: SMD5050 RGB LEDs(Built-in IC) ROHS; Manufacturer: Worldsemi; Supplier: LCSC; Supplier Part Number: C114586; Manufacturer Part Number: WS2812B-B/W
U?#3 = 74LVC1T45DW-7: Bus Transceiver, LVC/LCX/Z Series, 1-Func, 1-Bit, True Output, CMOS, PDSO6; Manufacturer: Diodes; Package Body Material: Plastic; Control Type: COMMON CONTROL; Count Direction: Bidirectional; Load/Preset Input: Yes; Max I(ol): 24mA; Number of Bits: 1; Number of Ports: 2; Output Characteristics: 3-STATE; Package Equivalence Code: TSSOP6,.08; Power Supplies: 3.3V; Max Supply Voltage: 5.5V; Min Supply Voltage: 1.65V; Qualification Status: Not Qualified; Supplier: Future Electronics; Supplier Part Number: 3070442; Manufacturer Part Number: 74LVC1T45DW-7; RoHS: Yes; Stock: 42000; Pricing: 3000=0.0512, 9000=0.0494, 15000=0.0485, 60000=0.0463, 90000=0.0449 (USD); Case/Package: TSSOP; Pins: 6; Package Shape: Rectangular; Terminal Finish: Tin; Min Operating Temperature: -40°C; Max Operating Temperature: 125°C; JESD-609 Code: e3; Output Polarity: True; JESD-30 Code: R-PDSO-G6; Logic Type: BUS TRANSCEIVER; Moisture Sensitivity Level: 1; Channels: 1; Package Style: SMALL OUTLINE, THIN PROFILE, SHRINK PITCHMeter; Packaging: Tape and Reel; Nominal Supply Voltage: 3.3V; Surface Mount: Yes; Technology: CMOS; Terminal Form: Gull Wing; Terminal Position: DUAL; Length: 2mm; Width: 1.25mm; Height - Seated (Max): 1.1mm; Terminal Pitch: 0.65mm; Temperature Grade: AUTOMOTIVE; Reach SVHC Compliant: Yes; RoHS Compliant: Yes; ComponentLink1URL: https://datasheet.ciiva.com:443/pdfs/VipMasterIC/IC/DIOD/DIOD-S-A0006644025/DIOD-S-A0006644025-1.pdf?src-supplier=IHS+Markit; ComponentLink1Description: https://datasheet.ciiva.com:443/pdfs/VipMasterIC/IC/DIOD/DIOD-S-A0006644025/DIOD-S-A0006644025-1.pdf?src-supplier=IHS+Markit; ComponentLink2URL: http://www.mouser.com/ds/2/115/74LVC1T45-318124.pdf?src-supplier=Mouser; ComponentLink2Description: http://www.mouser.com/ds/2/115/74LVC1T45-318124.pdf?src-supplier=Mouser; ComponentLink3URL: https://www.diodes.com/assets/Datasheets/74LVC1T45.pdf?src-supplier=Digikey; ComponentLink3Description: https://www.diodes.com/assets/Datasheets/74LVC1T45.pdf?src-supplier=Digikey; ComponentLink4URL: https://datasheet.octopart.com/74LVC1T45DW-7-Diodes-Inc.-datasheet-160640065.pdf?src-supplier=Newark; ComponentLink4Description: https://datasheet.octopart.com/74LVC1T45DW-7-Diodes-Inc.-datasheet-160640065.pdf?src-supplier=Newark; ComponentLink5URL: http://www.diodes.com/datasheets/74LVC1T45.pdf?src-supplier=Avnet; ComponentLink5Description: http://www.diodes.com/datasheets/74LVC1T45.pdf?src-supplier=Avnet

## Sheet Shift Registers.SchDoc
size A4; SheetNumber: 4; SheetTotal: 4
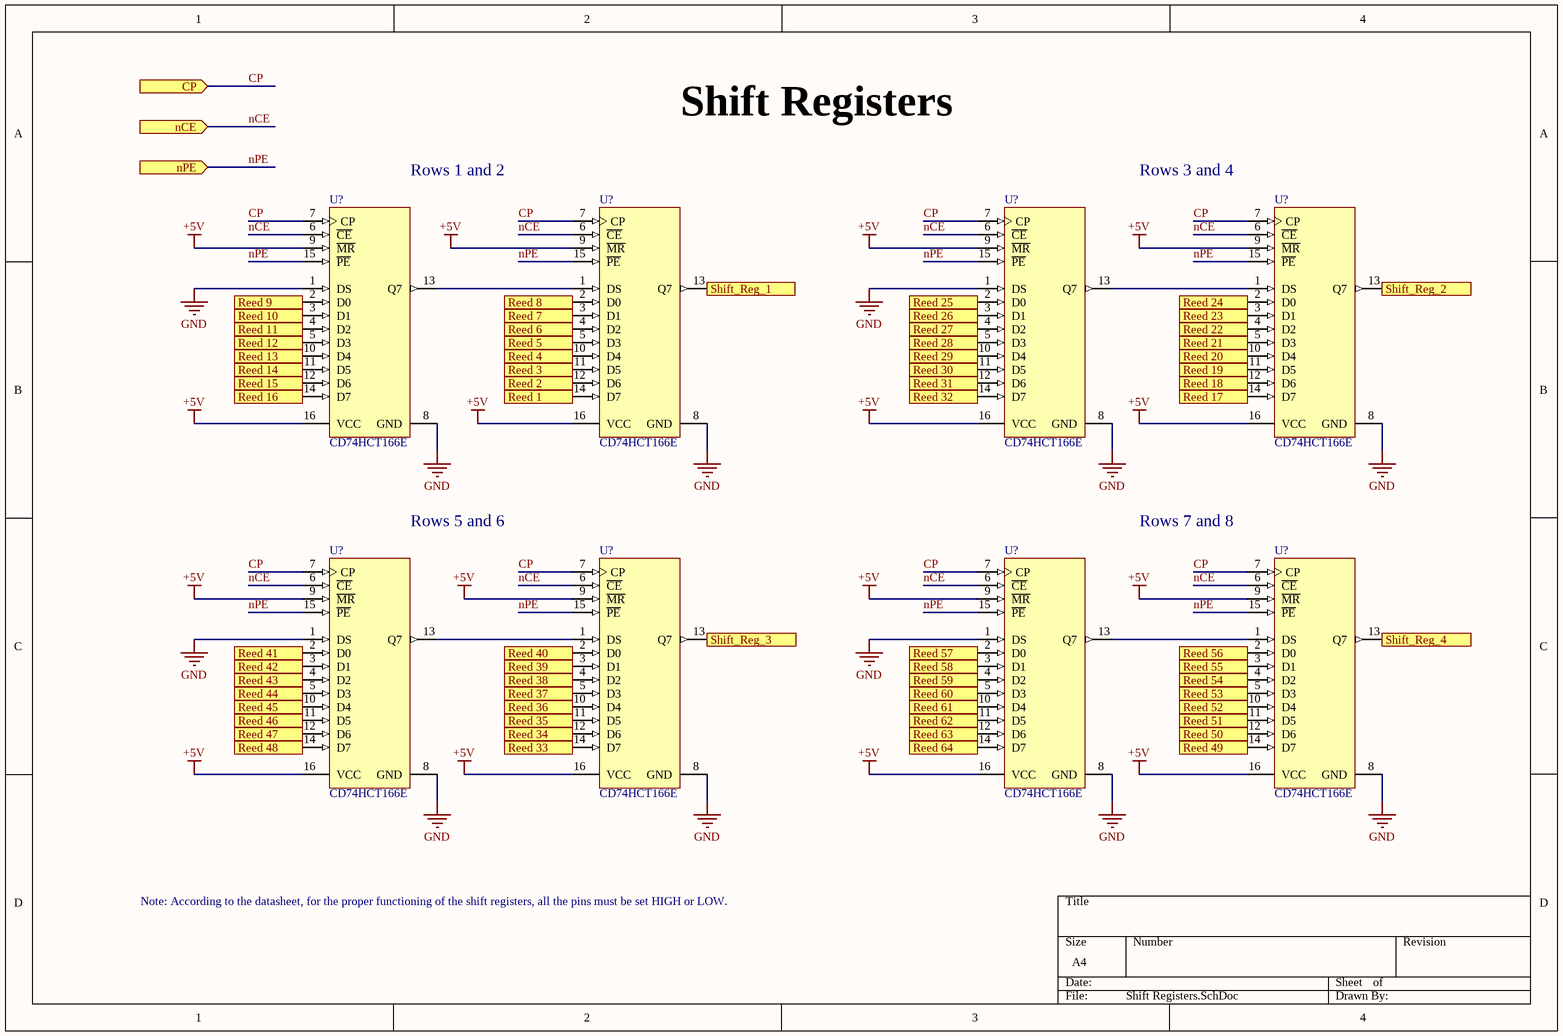
[diagram p3: Shift Registers.SchDoc]

### Parts
(Parts that share a designator on the sheet are numbered #1, #2 ... from top to bottom, then left to right.)
U?#4  CD74HCT166E  [N0016A]
U?#5  CD74HCT166E  [N0016A]
U?#6  CD74HCT166E  [N0016A]
U?#7  CD74HCT166E  [N0016A]
U?#8  CD74HCT166E  [N0016A]
U?#9  CD74HCT166E  [N0016A]
U?#10  CD74HCT166E  [N0016A]
U?#11  CD74HCT166E  [N0016A]

### Ports
CP (in), nCE (in), nPE (in), Reed 1 (in, see Reed Switches[1A]), Reed 2 (in, see Reed Switches[2A]), Reed 3 (in, see Reed Switches[3A]), Reed 4 (in, see Reed Switches[4A]), Reed 5 (in, see Reed Switches[5A]), Reed 6 (in, see Reed Switches[5A]), Reed 7 (in, see Reed Switches[6A]), Reed 8 (in, see Reed Switches[7A]), Reed 9 (in, see Reed Switches[1B]), Reed 10 (in, see Reed Switches[2B]), Reed 11 (in, see Reed Switches[3B]), Reed 12 (in, see Reed Switches[4B]), Reed 13 (in, see Reed Switches[5B]), Reed 14 (in, see Reed Switches[5B]), Reed 15 (in, see Reed Switches[6B]), Reed 16 (in, see Reed Switches[7B]), Reed 17 (in, see Reed Switches[1B]), Reed 18 (in, see Reed Switches[2B]), Reed 19 (in, see Reed Switches[3B]), Reed 20 (in, see Reed Switches[4B]), Reed 21 (in, see Reed Switches[5B]), Reed 22 (in, see Reed Switches[5B]), Reed 23 (in, see Reed Switches[6B]), Reed 24 (in, see Reed Switches[7B]), Reed 25 (in, see Reed Switches[1B]), Reed 26 (in, see Reed Switches[2B]), Reed 27 (in, see Reed Switches[3B]), Reed 28 (in, see Reed Switches[4B]), Reed 29 (in, see Reed Switches[5B]), Reed 30 (in, see Reed Switches[5B]), Reed 31 (in, see Reed Switches[6B]), Reed 32 (in, see Reed Switches[7B]), Reed 33 (in, see Reed Switches[1C]), Reed 34 (in, see Reed Switches[2C]), Reed 35 (in, see Reed Switches[3C]), Reed 36 (in, see Reed Switches[4C]), Reed 37 (in, see Reed Switches[5C]), Reed 38 (in, see Reed Switches[5C]), Reed 39 (in, see Reed Switches[6C]), Reed 40 (in, see Reed Switches[7C]), Reed 41 (in, see Reed Switches[1C]), Reed 42 (in, see Reed Switches[2C]), Reed 43 (in, see Reed Switches[3C]), Reed 44 (in, see Reed Switches[4C]), Reed 45 (in, see Reed Switches[5C]), Reed 46 (in, see Reed Switches[5C]), Reed 47 (in, see Reed Switches[6C]), Reed 48 (in, see Reed Switches[7C]), Reed 49 (in, see Reed Switches[1C]), Reed 50 (in, see Reed Switches[2C]), Reed 51 (in, see Reed Switches[3C]), Reed 52 (in, see Reed Switches[4C]), Reed 53 (in, see Reed Switches[5C]), Reed 54 (in, see Reed Switches[5C]), Reed 55 (in, see Reed Switches[6C]), Reed 56 (in, see Reed Switches[7C]), Reed 57 (in, see Reed Switches[1D]), Reed 58 (in, see Reed Switches[2D]), Reed 59 (in, see Reed Switches[3D]), Reed 60 (in, see Reed Switches[4D]), Reed 61 (in, see Reed Switches[5D]), Reed 62 (in, see Reed Switches[5D]), Reed 63 (in, see Reed Switches[6D]), Reed 64 (in, see Reed Switches[7D]), Shift_Reg_1 (out), Shift_Reg_2 (out), Shift_Reg_3 (out), Shift_Reg_4 (out)

### Nets
+5V: U?#4.9(~{MR}) U?#4.16(VCC) U?#5.9(~{MR}) U?#5.16(VCC) U?#6.9(~{MR}) U?#6.16(VCC) U?#7.9(~{MR}) U?#7.16(VCC) U?#8.9(~{MR}) U?#8.16(VCC) U?#9.9(~{MR}) U?#9.16(VCC) U?#10.9(~{MR}) U?#10.16(VCC) U?#11.9(~{MR}) U?#11.16(VCC)
GND: U?#4.1(DS) U?#4.8(GND) U?#5.8(GND) U?#6.1(DS) U?#6.8(GND) U?#7.8(GND) U?#8.1(DS) U?#8.8(GND) U?#9.8(GND) U?#10.1(DS) U?#10.8(GND) U?#11.8(GND)
CP: U?#4.7(CP) U?#5.7(CP) U?#6.7(CP) U?#7.7(CP) U?#8.7(CP) U?#9.7(CP) U?#10.7(CP) U?#11.7(CP) ; port CP
nCE: U?#4.6(~{CE}) U?#5.6(~{CE}) U?#6.6(~{CE}) U?#7.6(~{CE}) U?#8.6(~{CE}) U?#9.6(~{CE}) U?#10.6(~{CE}) U?#11.6(~{CE}) ; port nCE
nPE: U?#4.15(~{PE}) U?#5.15(~{PE}) U?#6.15(~{PE}) U?#7.15(~{PE}) U?#8.15(~{PE}) U?#9.15(~{PE}) U?#10.15(~{PE}) U?#11.15(~{PE}) ; port nPE
NetR?#1_2: U?#5.14(D7) ; port Reed 1
NetR?#2_2: U?#5.12(D6) ; port Reed 2
NetR?#3_2: U?#5.11(D5) ; port Reed 3
NetR?#4_2: U?#5.10(D4) ; port Reed 4
NetR?#5_2: U?#5.5(D3) ; port Reed 5
NetR?#6_2: U?#5.4(D2) ; port Reed 6
NetR?#7_2: U?#5.3(D1) ; port Reed 7
NetR?#8_2: U?#5.2(D0) ; port Reed 8
NetR?#9_2: U?#4.2(D0) ; port Reed 9
NetR?#10_2: U?#4.3(D1) ; port Reed 10
NetR?#11_2: U?#4.4(D2) ; port Reed 11
NetR?#12_2: U?#4.5(D3) ; port Reed 12
NetR?#13_2: U?#4.10(D4) ; port Reed 13
NetR?#14_2: U?#4.11(D5) ; port Reed 14
NetR?#15_2: U?#4.12(D6) ; port Reed 15
NetR?#16_2: U?#4.14(D7) ; port Reed 16
NetR?#17_2: U?#7.14(D7) ; port Reed 17
NetR?#18_2: U?#7.12(D6) ; port Reed 18
NetR?#19_2: U?#7.11(D5) ; port Reed 19
NetR?#20_2: U?#7.10(D4) ; port Reed 20
NetR?#21_2: U?#7.5(D3) ; port Reed 21
NetR?#22_2: U?#7.4(D2) ; port Reed 22
NetR?#23_2: U?#7.3(D1) ; port Reed 23
NetR?#24_2: U?#7.2(D0) ; port Reed 24
NetR?#25_2: U?#6.2(D0) ; port Reed 25
NetR?#26_2: U?#6.3(D1) ; port Reed 26
NetR?#27_2: U?#6.4(D2) ; port Reed 27
NetR?#28_2: U?#6.5(D3) ; port Reed 28
NetR?#29_2: U?#6.10(D4) ; port Reed 29
NetR?#30_2: U?#6.11(D5) ; port Reed 30
NetR?#31_2: U?#6.12(D6) ; port Reed 31
NetR?#32_2: U?#6.14(D7) ; port Reed 32
NetR?#33_2: U?#9.14(D7) ; port Reed 33
NetR?#34_2: U?#9.12(D6) ; port Reed 34
NetR?#35_2: U?#9.11(D5) ; port Reed 35
NetR?#36_2: U?#9.10(D4) ; port Reed 36
NetR?#37_2: U?#9.5(D3) ; port Reed 37
NetR?#38_2: U?#9.4(D2) ; port Reed 38
NetR?#39_2: U?#9.3(D1) ; port Reed 39
NetR?#40_2: U?#9.2(D0) ; port Reed 40
NetR?#41_2: U?#8.2(D0) ; port Reed 41
NetR?#42_2: U?#8.3(D1) ; port Reed 42
NetR?#43_2: U?#8.4(D2) ; port Reed 43
NetR?#44_2: U?#8.5(D3) ; port Reed 44
NetR?#45_2: U?#8.10(D4) ; port Reed 45
NetR?#46_2: U?#8.11(D5) ; port Reed 46
NetR?#47_2: U?#8.12(D6) ; port Reed 47
NetR?#48_2: U?#8.14(D7) ; port Reed 48
NetR?#49_2: U?#11.14(D7) ; port Reed 49
NetR?#50_2: U?#11.12(D6) ; port Reed 50
NetR?#51_2: U?#11.11(D5) ; port Reed 51
NetR?#52_2: U?#11.10(D4) ; port Reed 52
NetR?#53_2: U?#11.5(D3) ; port Reed 53
NetR?#54_2: U?#11.4(D2) ; port Reed 54
NetR?#55_2: U?#11.3(D1) ; port Reed 55
NetR?#56_2: U?#11.2(D0) ; port Reed 56
NetR?#57_2: U?#10.2(D0) ; port Reed 57
NetR?#58_2: U?#10.3(D1) ; port Reed 58
NetR?#59_2: U?#10.4(D2) ; port Reed 59
NetR?#60_2: U?#10.5(D3) ; port Reed 60
NetR?#61_2: U?#10.10(D4) ; port Reed 61
NetR?#62_2: U?#10.11(D5) ; port Reed 62
NetR?#63_2: U?#10.12(D6) ; port Reed 63
NetR?#64_2: U?#10.14(D7) ; port Reed 64
NetU?#4_13: U?#4.13(Q7) U?#5.1(DS)
NetU?#5_13: U?#5.13(Q7) ; port Shift_Reg_1
NetU?#6_13: U?#6.13(Q7) U?#7.1(DS)
NetU?#7_13: U?#7.13(Q7) ; port Shift_Reg_2
NetU?#8_13: U?#8.13(Q7) U?#9.1(DS)
NetU?#9_13: U?#9.13(Q7) ; port Shift_Reg_3
NetU?#10_13: U?#10.13(Q7) U?#11.1(DS)
NetU?#11_13: U?#11.13(Q7) ; port Shift_Reg_4

### Notes on the sheet
- (near U?#4) Rows 1 and 2
- Shift Registers
- (near U?#7) Rows 3 and 4
- (near U?#8) Rows 5 and 6
- (near U?#11) Rows 7 and 8
- Note: According to the datasheet, for the proper functioning of the shift registers, all the pins must be set HIGH or LOW.

### Library data of the parts
U?#4-U?#11 = CMP-0807-00166-3: High Speed CMOS Logic 8-Bit Parallel-In/Serial-Out Shift Register, N0016A, TUBE; Manufacturer: Texas Instruments; Voltage(Nom)(V): 5; Bits: 8; Output Drive (IOL/IOH)(Max)(mA): 4/-4; F @ Nom Voltage(Max)(Mhz): 25; VCC(Max)(V): 5.5; 3-State Output: No; VCC(Min)(V): 4.5; tpd @ Nom Voltage(Max)(ns): 50; Technology Family: HCT; Input Type: TTL; ICC @ Nom Voltage(Max)(mA): 0.08; Rating: Catalog; Operating Temperature Range(C): -55 to 125; PackageVersion: http://www.ti.com/lit/ml/mpdi002c/mpdi002c.pdf; DatasheetVersion: SCHS157C; Generic Part Number: CD74HCT166; PackageReference: N0016A; Code_JEDEC: MS-001; Output Type: CMOS

## Nets that join several sheets
+3V3: Microcontroller (C?#2.2 U?#1.5), LEDs (C?#68.2 U?#3.1)
+5V: Microcontroller (C?#1.2 U?#1.1 U?#1.3), LEDs (131 pins), Shift Registers (16 pins)
GND: Microcontroller (7 pins), Reed Switches (64 pins), LEDs (131 pins), Shift Registers (12 pins)
NetR?#1_2: Reed Switches (R?#1.2 SW?#1.1), Shift Registers (U?#5.14)
NetR?#2_2: Reed Switches (R?#2.2 SW?#2.1), Shift Registers (U?#5.12)
NetR?#3_2: Reed Switches (R?#3.2 SW?#3.1), Shift Registers (U?#5.11)
NetR?#4_2: Reed Switches (R?#4.2 SW?#4.1), Shift Registers (U?#5.10)
NetR?#5_2: Reed Switches (R?#5.2 SW?#5.1), Shift Registers (U?#5.5)
NetR?#6_2: Reed Switches (R?#6.2 SW?#6.1), Shift Registers (U?#5.4)
NetR?#7_2: Reed Switches (R?#7.2 SW?#7.1), Shift Registers (U?#5.3)
NetR?#8_2: Reed Switches (R?#8.2 SW?#8.1), Shift Registers (U?#5.2)
NetR?#9_2: Reed Switches (R?#9.2 SW?#9.1), Shift Registers (U?#4.2)
NetR?#10_2: Reed Switches (R?#10.2 SW?#10.1), Shift Registers (U?#4.3)
NetR?#11_2: Reed Switches (R?#11.2 SW?#11.1), Shift Registers (U?#4.4)
NetR?#12_2: Reed Switches (R?#12.2 SW?#12.1), Shift Registers (U?#4.5)
NetR?#13_2: Reed Switches (R?#13.2 SW?#13.1), Shift Registers (U?#4.10)
NetR?#14_2: Reed Switches (R?#14.2 SW?#14.1), Shift Registers (U?#4.11)
NetR?#15_2: Reed Switches (R?#15.2 SW?#15.1), Shift Registers (U?#4.12)
NetR?#16_2: Reed Switches (R?#16.2 SW?#16.1), Shift Registers (U?#4.14)
NetR?#17_2: Reed Switches (R?#17.2 SW?#17.1), Shift Registers (U?#7.14)
NetR?#18_2: Reed Switches (R?#18.2 SW?#18.1), Shift Registers (U?#7.12)
NetR?#19_2: Reed Switches (R?#19.2 SW?#19.1), Shift Registers (U?#7.11)
NetR?#20_2: Reed Switches (R?#20.2 SW?#20.1), Shift Registers (U?#7.10)
NetR?#21_2: Reed Switches (R?#21.2 SW?#21.1), Shift Registers (U?#7.5)
NetR?#22_2: Reed Switches (R?#22.2 SW?#22.1), Shift Registers (U?#7.4)
NetR?#23_2: Reed Switches (R?#23.2 SW?#23.1), Shift Registers (U?#7.3)
NetR?#24_2: Reed Switches (R?#24.2 SW?#24.1), Shift Registers (U?#7.2)
NetR?#25_2: Reed Switches (R?#25.2 SW?#25.1), Shift Registers (U?#6.2)
NetR?#26_2: Reed Switches (R?#26.2 SW?#26.1), Shift Registers (U?#6.3)
NetR?#27_2: Reed Switches (R?#27.2 SW?#27.1), Shift Registers (U?#6.4)
NetR?#28_2: Reed Switches (R?#28.2 SW?#28.1), Shift Registers (U?#6.5)
NetR?#29_2: Reed Switches (R?#29.2 SW?#29.1), Shift Registers (U?#6.10)
NetR?#30_2: Reed Switches (R?#30.2 SW?#30.1), Shift Registers (U?#6.11)
NetR?#31_2: Reed Switches (R?#31.2 SW?#31.1), Shift Registers (U?#6.12)
NetR?#32_2: Reed Switches (R?#32.2 SW?#32.1), Shift Registers (U?#6.14)
NetR?#33_2: Reed Switches (R?#33.2 SW?#33.1), Shift Registers (U?#9.14)
NetR?#34_2: Reed Switches (R?#34.2 SW?#34.1), Shift Registers (U?#9.12)
NetR?#35_2: Reed Switches (R?#35.2 SW?#35.1), Shift Registers (U?#9.11)
NetR?#36_2: Reed Switches (R?#36.2 SW?#36.1), Shift Registers (U?#9.10)
NetR?#37_2: Reed Switches (R?#37.2 SW?#37.1), Shift Registers (U?#9.5)
NetR?#38_2: Reed Switches (R?#38.2 SW?#38.1), Shift Registers (U?#9.4)
NetR?#39_2: Reed Switches (R?#39.2 SW?#39.1), Shift Registers (U?#9.3)
NetR?#40_2: Reed Switches (R?#40.2 SW?#40.1), Shift Registers (U?#9.2)
NetR?#41_2: Reed Switches (R?#41.2 SW?#41.1), Shift Registers (U?#8.2)
NetR?#42_2: Reed Switches (R?#42.2 SW?#42.1), Shift Registers (U?#8.3)
NetR?#43_2: Reed Switches (R?#43.2 SW?#43.1), Shift Registers (U?#8.4)
NetR?#44_2: Reed Switches (R?#44.2 SW?#44.1), Shift Registers (U?#8.5)
NetR?#45_2: Reed Switches (R?#45.2 SW?#45.1), Shift Registers (U?#8.10)
NetR?#46_2: Reed Switches (R?#46.2 SW?#46.1), Shift Registers (U?#8.11)
NetR?#47_2: Reed Switches (R?#47.2 SW?#47.1), Shift Registers (U?#8.12)
NetR?#48_2: Reed Switches (R?#48.2 SW?#48.1), Shift Registers (U?#8.14)
NetR?#49_2: Reed Switches (R?#49.2 SW?#49.1), Shift Registers (U?#11.14)
NetR?#50_2: Reed Switches (R?#50.2 SW?#50.1), Shift Registers (U?#11.12)
NetR?#51_2: Reed Switches (R?#51.2 SW?#51.1), Shift Registers (U?#11.11)
NetR?#52_2: Reed Switches (R?#52.2 SW?#52.1), Shift Registers (U?#11.10)
NetR?#53_2: Reed Switches (R?#53.2 SW?#53.1), Shift Registers (U?#11.5)
NetR?#54_2: Reed Switches (R?#54.2 SW?#54.1), Shift Registers (U?#11.4)
NetR?#55_2: Reed Switches (R?#55.2 SW?#55.1), Shift Registers (U?#11.3)
NetR?#56_2: Reed Switches (R?#56.2 SW?#56.1), Shift Registers (U?#11.2)
NetR?#57_2: Reed Switches (R?#57.2 SW?#57.1), Shift Registers (U?#10.2)
NetR?#58_2: Reed Switches (R?#58.2 SW?#58.1), Shift Registers (U?#10.3)
NetR?#59_2: Reed Switches (R?#59.2 SW?#59.1), Shift Registers (U?#10.4)
NetR?#60_2: Reed Switches (R?#60.2 SW?#60.1), Shift Registers (U?#10.5)
NetR?#61_2: Reed Switches (R?#61.2 SW?#61.1), Shift Registers (U?#10.10)
NetR?#62_2: Reed Switches (R?#62.2 SW?#62.1), Shift Registers (U?#10.11)
NetR?#63_2: Reed Switches (R?#63.2 SW?#63.1), Shift Registers (U?#10.12)
NetR?#64_2: Reed Switches (R?#64.2 SW?#64.1), Shift Registers (U?#10.14)